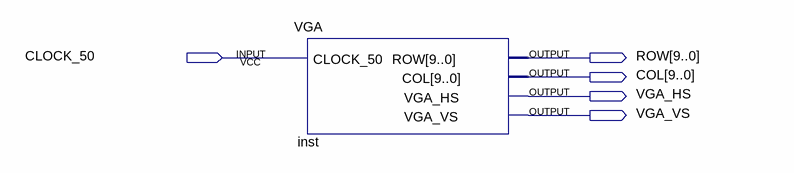
[diagram p0: schematic sheet]
// Quartus schematic PAC-MAN.bdf as structural Verilog: 1 symbols, 5 pins
module \PAC-MAN  (
  input  CLOCK_50,
  output [9:0] ROW,
  output [9:0] COL,
  output VGA_HS,
  output VGA_VS
);

  VGA inst (.CLOCK_50(CLOCK_50), .ROW(ROW), .COL(COL), .VGA_HS(VGA_HS), .VGA_VS(VGA_VS));
endmodule
